# Altium schematic sheet temp2.SchDoc
size A; SheetNumber: 2; SheetTotal: 2
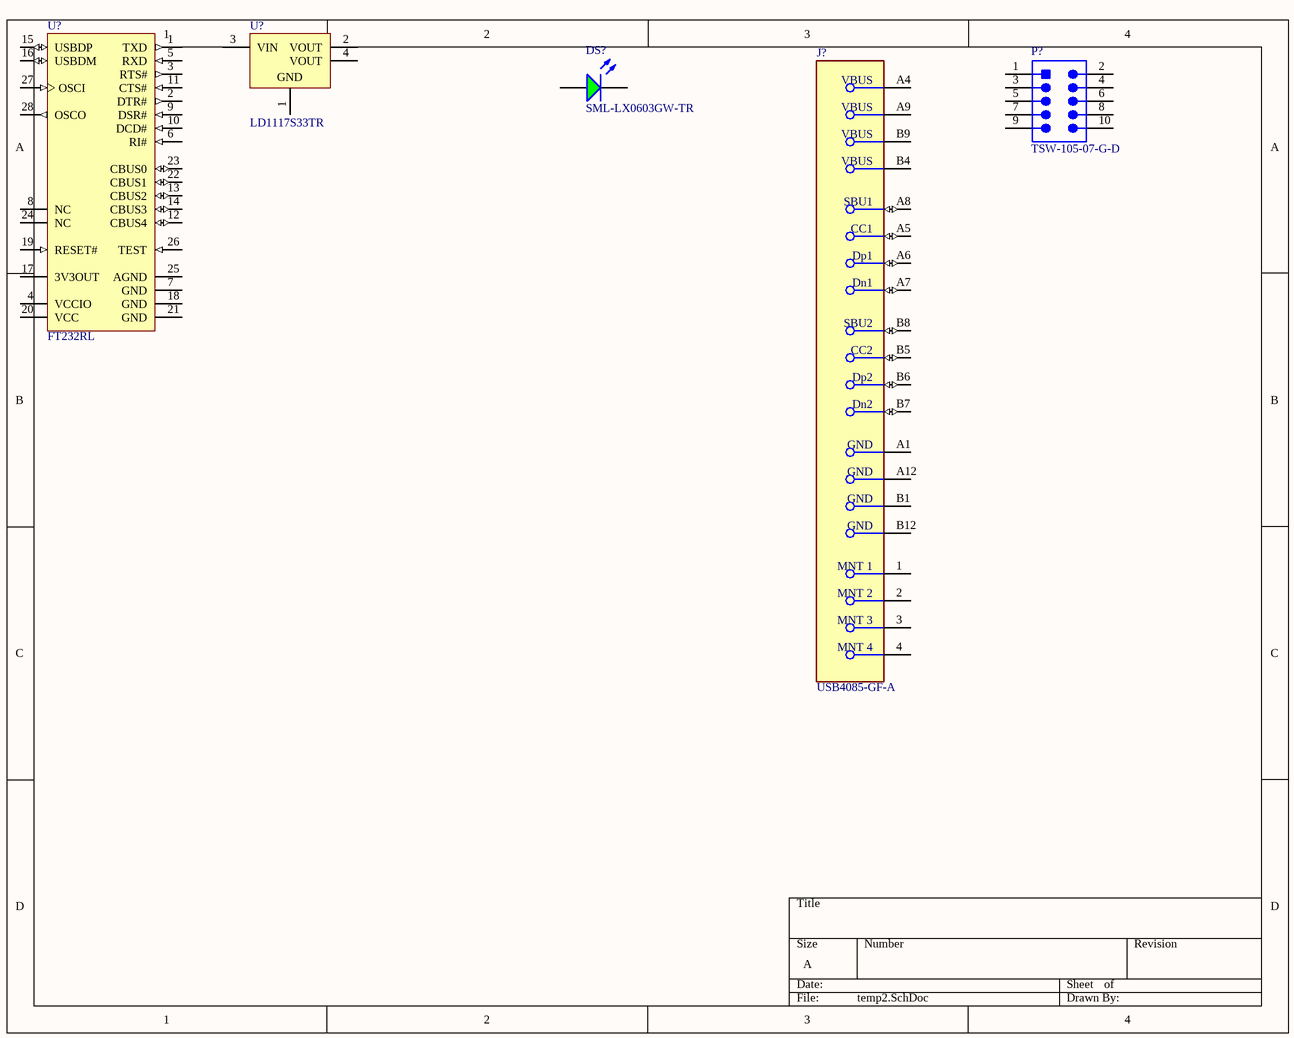
[diagram p0: temp2.SchDoc]

## Parts
(Parts that share a designator on the sheet are numbered #1, #2 ... from top to bottom, then left to right.)
DS?  SML-LX0603GW-TR  [LUMX-SML-LX0603_V]
J?  USB4085-GF-A  [FP-USB4085-GF-A-MFG]
P?  TSW-105-07-G-D  [SMTC-TSW-105-07-G-D_V]
U?#1  FT232RL  [FTDI-SSOP-28_M]
U?#2  LD1117S33TR  [SOT-223_L]

## Nets

Not connected (* = marked no-connect by the designer): DS? 1(A) 2(K); J? 1(MNT_1) 2(MNT_2) 3(MNT_3) 4(MNT_4) A1(GND) A4(VBUS) A5(CC1) A6(Dp1) A7(Dn1) A8(SBU1) A9(VBUS) A12(GND) B1(GND) B4(VBUS) B5(CC2) B6(Dp2) B7(Dn2) B8(SBU2) B9(VBUS) B12(GND); P? 1 2 3 4 5 6 7 8 9 10; U?#1 1(TXD) 2(DTR#) 3(RTS#) 4(VCCIO) 5(RXD) 6(RI#) 7(GND) 8(NC) 9(DSR#) 10(DCD#) 11(CTS#) 12(CBUS4) 13(CBUS2) 14(CBUS3) 15(USBDP) 16(USBDM) 17(3V3OUT) 18(GND) 19(RESET#) 20(VCC) 21(GND) 22(CBUS1) 23(CBUS0) 24(NC) 25(AGND) 26(TEST) 27(OSCI) 28(OSCO); U?#2 1(GND) 2(VOUT) 3(VIN) 4(VOUT)

## Library data of the parts
DS? = CMP-2000-07120-1: LED Green Diode, 18 mcd, 50 mW, -25 to 85 degC, 2-Pin SMD, RoHS, Tape and Reel; Manufacturer: Lumex; Peak Wavelength: 565nm; Viewing Angle: 160; LED Material: GaP; COO: CN; Lens Appearance: ColorlessDiffused; Pin_Count: 2; Type: Uni-Color; Intensity: 18mcd; Number of LEDs: 1; Reverse Voltage: 5(Min)V; Supplier: Lumex; ECCN: EAR99; Packaging: TapeandReel; Supplier Standard Pack: 4,000; Mounting: SurfaceMount; Operating Temperature: -25to85C; Package Description: 2-Pin Surface Mount Device, Body 1.6 x 0.8 mm; Family: SML-LX0603GW; Lens Dimensions: 1x0.8x0.3mm; Dominant Wavelength: N/A; Package Reference: SML-LX00603; HTS: 8541402000; Mounting Technology: SurfaceMount; Datasheet Version: Rev. G, 09/2013; Manufacturer URL: http://www.lumexinstruments.com/; RoHS: Yes; Datasheet URL: http://www.lumex.com/content/files/ProductAttachment/SML-LX0603GW-TR.pdf; Supplier_Package: SMD; Part No: SML-LX0603GW-TR; Color: Green; Dimension: 1.6x0.8x0.6mm
J? = CMP-196119-000001-2: CONN RCPT USB2.0 TYPE C 24POS RA; Gender: Receptacle; Number of Positions: 16; USB Standard: USB 2.0; Orientation: Right Angle; Contact Plating: Gold; Contact Material: Copper Alloy
P? = CMP-2000-07330-1: Post Terminal Strip Assembly, Pitch 2.54 mm, 2 x 5 Position, Height 8.58 mm, Tail Length 2.54 mm, -55 to 125 degC, RoHS, Bulk; Manufacturer: Samtec-Inc.; Connector Type: Header,Unshrouded; Number of Positions Loaded: All; Pitch: 0.100"(2.54mm); Number of Positions: 10; Package Reference: TSW-105-07-G-D; Mounting Technology: ThroughHole; Datasheet URL: http://suddendocs.samtec.com/prints/tsw-xxx-xx-xxx-x-xx-xxx-mkt.pdf; Termination: Solder; Packaging: Bulk; Number of Rows: 2; Contact Finish: Gold; Mounting Type: ThroughHole; Features: -; Color: Black; Category: Connectors,Interconnects; Family: RectangularConnectors-Headers,MalePins; Manufacturer URL: http://www.samtec.com/; Series: TSW; Fastening Type: -; Package URL: http://suddendocs.samtec.com/prints/tsw-xxx-xx-x-x-xx-xxx-footprint.pdf; Row Spacing: 0.100"(2.54mm); Contact Mating Length: 0.230"(5.84mm); Contact Finish Thickness: 10µin(0.25µm); Contact Type: MalePin; Package Description: Male Header, Pitch 2.54 mm, 2 x 5 Position, Height 8.58 mm, Tail Length 2.54 mm; Datasheet Version: Rev. DO, 08/1988
U?#1 = CMP-2000-05029-1: IC USB FS SERIAL UART 28-SSOP; Manufacturer: FTDI; Receive FIFO: 256B; Number of Channels per Chip: 1; Maximum Data Rate: 3MBd; Transmit FIFO: 128B; Dimensions: 10.2x5.3x1.75mm; Mounting Type: SurfaceMount; Height: 1.75mm; Package Type: SSOP; Datasheet Version: Rev. 1.04, 02/2006; Width: 5.3mm; Manufacturer URL: http://www.ftdichip.com/; Datasheet URL: http://datasheet.octopart.com/FT232RL-FTDI-datasheet-120501.pdf; Maximum Operating Temperature: +85degC; Minimum Operating Temperature: -40degC; Pin Count: 28; Length: 10.2mm
U?#2 = CMP-0244-00310-1: Fixed Low Drop Positive Voltage Regulator, 3.3V, 4-Pin SOT-223, Tape and Reel; ComponentLink2Description: Datasheet; PackageDescription: 4-Pin SOT-223 Package, 6.5 x 3.5 mm Body, 2.3 mm Pitch, 7 mm Lead Span; PackageVersion: 2010; ComponentLink2URL: http://www.st.com/internet/com/TECHNICAL_RESOURCES/TECHNICAL_LITERATURE/DATASHEET/CD00000544.pdf; PackageReference: SOT-223; DatasheetVersion: 1/11/2011; ComponentLink1Description: Manufacturer URL; ComponentLink1URL: http://www.st.com